# Altium project MyProject.PrjPcb
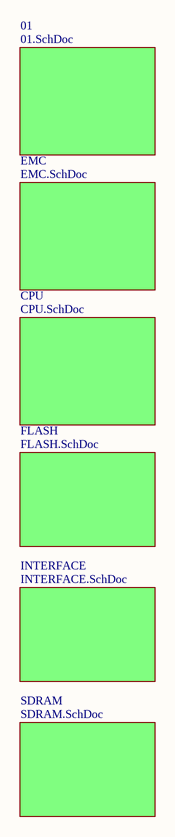
[diagram p0: Total.SchDoc]
7 sheets, 60 parts. Net scope: global (net labels, ports and power ports of the same name join across sheets).
Board file: PCB1.PcbDoc
Sheets:
  Total.SchDoc
    01 = 01.SchDoc
    CPU = CPU.SchDoc
    EMC = EMC.SchDoc
    FLASH = FLASH.SchDoc
    INTERFACE = INTERFACE.SchDoc
    SDRAM = SDRAM.SchDoc

## Sheet Total.SchDoc
size A4

### Sub-sheets
01 = 01.SchDoc: no entries
CPU = CPU.SchDoc: no entries
EMC = EMC.SchDoc: no entries
FLASH = FLASH.SchDoc: no entries
INTERFACE = INTERFACE.SchDoc: no entries
SDRAM = SDRAM.SchDoc: no entries

## Sheet 01.SchDoc
size A4
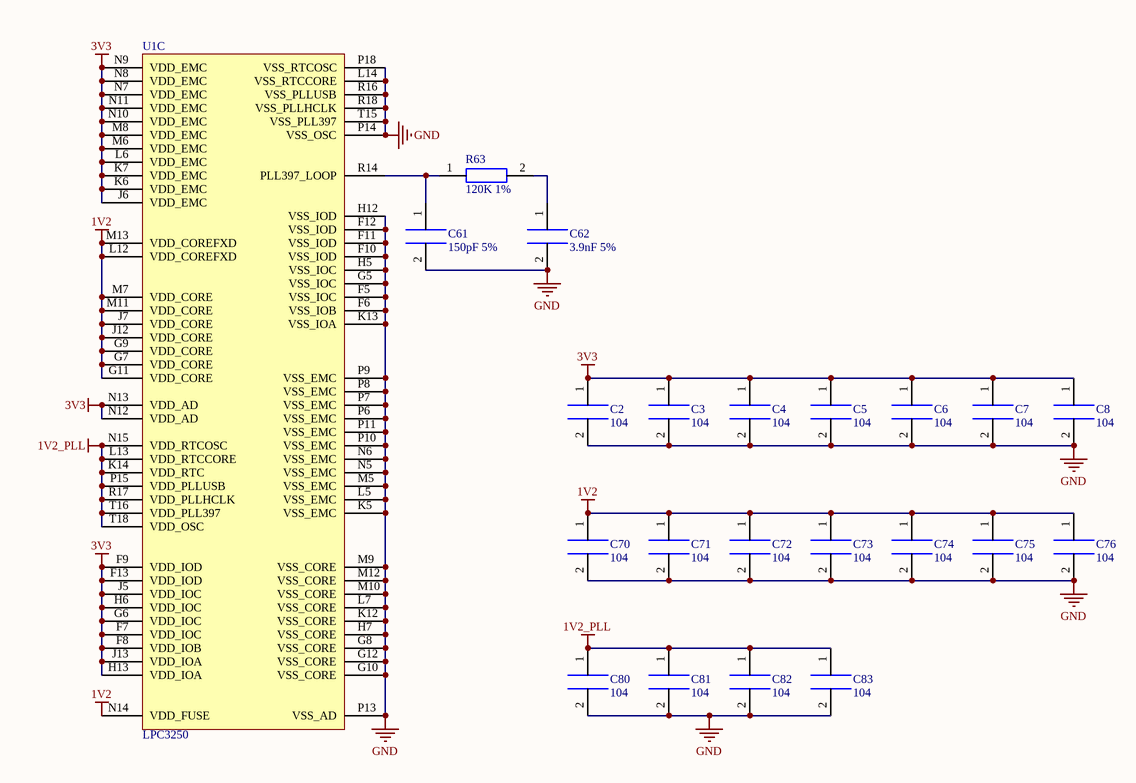
[diagram p1: 01.SchDoc]

### Parts
C2  104  [0603C]
C3  104  [0603C]
C4  104  [0603C]
C5  104  [0603C]
C6  104  [0603C]
C7  104  [0603C]
C8  104  [0603C]
C61  150pF 5%  [0603C]
C62  3.9nF 5%  [0603C]
C70  104  [0603C]
C71  104  [0603C]
C72  104  [0603C]
C73  104  [0603C]
C74  104  [0603C]
C75  104  [0603C]
C76  104  [0603C]
C80  104  [0603C]
C81  104  [0603C]
C82  104  [0603C]
C83  104  [0603C]
R63  120K 1%  [0603R]
U1  LPC3250  [TFBGA296]  (part C of 4)

### Nets
1V2: C70.1 C71.1 C72.1 C73.1 C74.1 C75.1 C76.1 U1.G7(VDD_CORE) U1.G9(VDD_CORE) U1.G11(VDD_CORE) U1.J7(VDD_CORE) U1.J12(VDD_CORE) U1.L12(VDD_COREFXD) U1.M7(VDD_CORE) U1.M11(VDD_CORE) U1.M13(VDD_COREFXD) U1.N14(VDD_FUSE)
1V2_PLL: C80.1 C81.1 C82.1 C83.1 U1.K14(VDD_RTC) U1.L13(VDD_RTCCORE) U1.N15(VDD_RTCOSC) U1.P15(VDD_PLLUSB) U1.R17(VDD_PLLHCLK) U1.T16(VDD_PLL397) U1.T18(VDD_OSC)
3V3: C2.1 C3.1 C4.1 C5.1 C6.1 C7.1 C8.1 U1.F7(VDD_IOC) U1.F8(VDD_IOB) U1.F9(VDD_IOD) U1.F13(VDD_IOD) U1.G6(VDD_IOC) U1.H6(VDD_IOC) U1.H13(VDD_IOA) U1.J5(VDD_IOC) U1.J6(VDD_EMC) U1.J13(VDD_IOA) U1.K6(VDD_EMC) U1.K7(VDD_EMC) U1.L6(VDD_EMC) U1.M6(VDD_EMC) U1.M8(VDD_EMC) U1.N7(VDD_EMC) U1.N8(VDD_EMC) U1.N9(VDD_EMC) U1.N10(VDD_EMC) U1.N11(VDD_EMC) U1.N12(VDD_AD) U1.N13(VDD_AD)
GND: C2.2 C3.2 C4.2 C5.2 C6.2 C7.2 C8.2 C61.2 C62.2 C70.2 C71.2 C72.2 C73.2 C74.2 C75.2 C76.2 C80.2 C81.2 C82.2 C83.2 U1.F5(VSS_IOC) U1.F6(VSS_IOB) U1.F10(VSS_IOD) U1.F11(VSS_IOD) U1.F12(VSS_IOD) U1.G5(VSS_IOC) U1.G8(VSS_CORE) U1.G10(VSS_CORE) U1.G12(VSS_CORE) U1.H5(VSS_IOC) U1.H7(VSS_CORE) U1.H12(VSS_IOD) U1.K5(VSS_EMC) U1.K12(VSS_CORE) U1.K13(VSS_IOA) U1.L5(VSS_EMC) U1.L7(VSS_CORE) U1.L14(VSS_RTCCORE) U1.M5(VSS_EMC) U1.M9(VSS_CORE) U1.M10(VSS_CORE) U1.M12(VSS_CORE) U1.N5(VSS_EMC) U1.N6(VSS_EMC) U1.P6(VSS_EMC) U1.P7(VSS_EMC) U1.P8(VSS_EMC) U1.P9(VSS_EMC) U1.P10(VSS_EMC) U1.P11(VSS_EMC) U1.P13(VSS_AD) U1.P14(VSS_OSC) U1.P18(VSS_RTCOSC) U1.R16(VSS_PLLUSB) U1.R18(VSS_PLLHCLK) U1.T15(VSS_PLL397)
NetC61_1: C61.1 R63.1 U1.R14(PLL397_LOOP)
NetC62_1: C62.1 R63.2

### Library data of the parts
C2-C8 C61 C62 C70-C76 C80-C83 = CAP
R63 = RES

## Sheet CPU.SchDoc
size A4
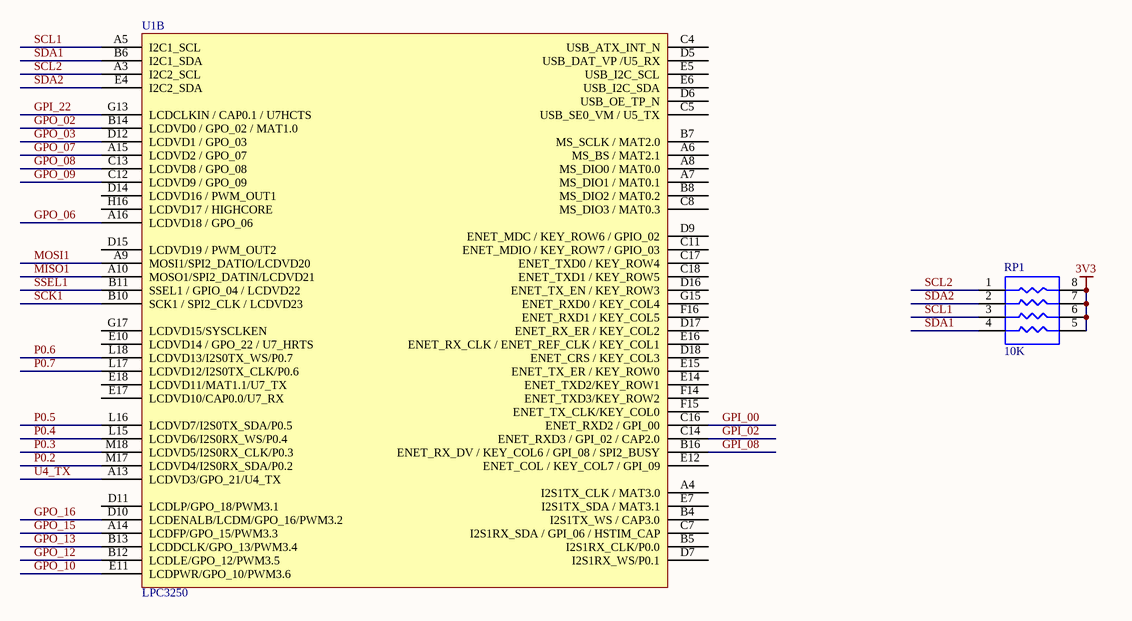
[diagram p2: CPU.SchDoc]

### Parts
RP1  10K  [PZ-4-0.8B]
U1  LPC3250  [TFBGA296]  (part B of 4)

### Nets
3V3: RP1.5 RP1.6 RP1.7 RP1.8
GPI_00: U1.C16(ENET_RXD2_/_GPI_00)
GPI_02: U1.C14(ENET_RXD3_/_GPI_02_/_CAP2.0)
GPI_08: U1.B16(ENET_RX_DV_/_KEY_COL6_/_GPI_08_/_SPI2_BUSY)
GPI_22: U1.G13(LCDCLKIN_/_CAP0.1_/_U7HCTS)
GPO_02: U1.B14(LCDVD0_/_GPO_02_/_MAT1.0)
GPO_03: U1.D12(LCDVD1_/_GPO_03)
GPO_06: U1.A16(LCDVD18_/_GPO_06)
GPO_07: U1.A15(LCDVD2_/_GPO_07)
GPO_08: U1.C13(LCDVD8_/_GPO_08)
GPO_09: U1.C12(LCDVD9_/_GPO_09)
GPO_10: U1.E11(LCDPWR/GPO_10/PWM3.6)
GPO_12: U1.B12(LCDLE/GPO_12/PWM3.5)
GPO_13: U1.B13(LCDDCLK/GPO_13/PWM3.4)
GPO_15: U1.A14(LCDFP/GPO_15/PWM3.3)
GPO_16: U1.D10(LCDENALB/LCDM/GPO_16/PWM3.2)
MISO1: U1.A10(MOSO1/SPI2_DATIN/LCDVD21)
MOSI1: U1.A9(MOSI1/SPI2_DATIO/LCDVD20)
P0.2: U1.M17(LCDVD4/I2S0RX_SDA/P0.2)
P0.3: U1.M18(LCDVD5/I2S0RX_CLK/P0.3)
P0.4: U1.L15(LCDVD6/I2S0RX_WS/P0.4)
P0.5: U1.L16(LCDVD7/I2S0TX_SDA/P0.5)
P0.6: U1.L18(LCDVD13/I2S0TX_WS/P0.7)
P0.7: U1.L17(LCDVD12/I2S0TX_CLK/P0.6)
SCK1: U1.B10(SCK1_/_SPI2_CLK_/_LCDVD23)
SCL1: RP1.3 U1.A5(I2C1_SCL)
SCL2: RP1.1 U1.A3(I2C2_SCL)
SDA1: RP1.4 U1.B6(I2C1_SDA)
SDA2: RP1.2 U1.E4(I2C2_SDA)
SSEL1: U1.B11(SSEL1_/_GPIO_04_/_LCDVD22)
U4_TX: U1.A13(LCDVD3/GPO_21/U4_TX)

Not connected (* = marked no-connect by the designer): U1 A4(I2S1TX_CLK_/_MAT3.0) A6(MS_BS_/_MAT2.1) A7(MS_DIO1_/_MAT0.1) A8(MS_DIO0_/_MAT0.0) B4(I2S1TX_WS_/_CAP3.0) B5(I2S1RX_CLK/P0.0) B7(MS_SCLK_/_MAT2.0) B8(MS_DIO2_/_MAT0.2) C4(USB_ATX_INT_N) C5(USB_SE0_VM_/_U5_TX) C7(I2S1RX_SDA_/_GPI_06_/_HSTIM_CAP) C8(MS_DIO3_/_MAT0.3) C11(ENET_MDIO_/_KEY_ROW7_/_GPIO_03) C17(ENET_TXD0_/_KEY_ROW4) C18(ENET_TXD1_/_KEY_ROW5) D5(USB_DAT_VP_/U5_RX) D6(USB_OE_TP_N) D7(I2S1RX_WS/P0.1) D9(ENET_MDC_/_KEY_ROW6_/_GPIO_02) D11(LCDLP/GPO_18/PWM3.1) D14(LCDVD16_/_PWM_OUT1) D15(LCDVD19_/_PWM_OUT2) D16(ENET_TX_EN_/_KEY_ROW3) D17(ENET_RX_ER_/_KEY_COL2) D18(ENET_CRS_/_KEY_COL3) E5(USB_I2C_SCL) E6(USB_I2C_SDA) E7(I2S1TX_SDA_/_MAT3.1) E10(LCDVD14_/_GPO_22_/_U7_HRTS) E12(ENET_COL_/_KEY_COL7_/_GPI_09) E14(ENET_TXD2/KEY_ROW1) E15(ENET_TX_ER_/_KEY_ROW0) E16(ENET_RX_CLK_/_ENET_REF_CLK_/_KEY_COL1) E17(LCDVD10/CAP0.0/U7_RX) E18(LCDVD11/MAT1.1/U7_TX) F14(ENET_TXD3/KEY_ROW2) F15(ENET_TX_CLK/KEY_COL0) F16(ENET_RXD1_/_KEY_COL5) G15(ENET_RXD0_/_KEY_COL4) G17(LCDVD15/SYSCLKEN) H16(LCDVD17_/_HIGHCORE)

### Library data of the parts
RP1 = RP

## Sheet EMC.SchDoc
size A4
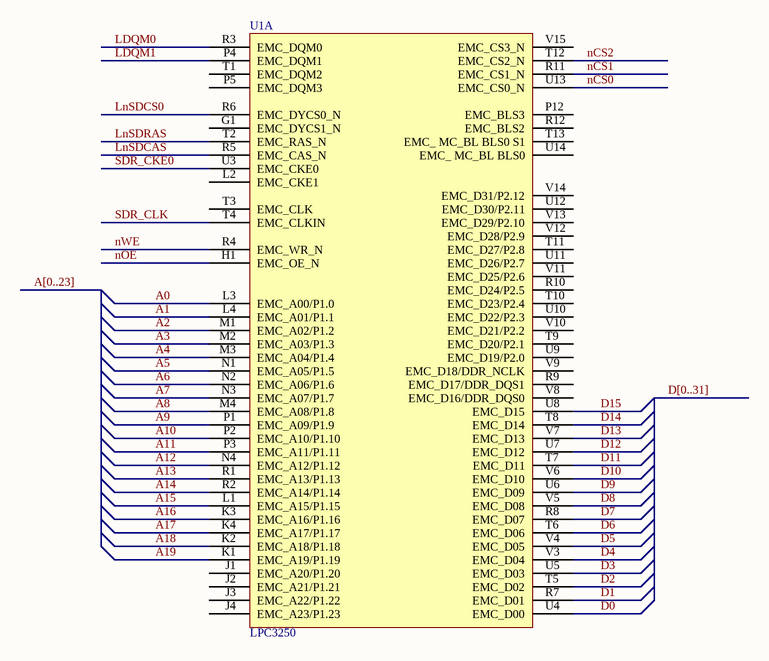
[diagram p3: EMC.SchDoc]

### Parts
U1  LPC3250  [TFBGA296]  (part A of 4)

### Nets
A0: U1.L3(EMC_A00/P1.0)
A1: U1.L4(EMC_A01/P1.1)
A2: U1.M1(EMC_A02/P1.2)
A3: U1.M2(EMC_A03/P1.3)
A4: U1.M3(EMC_A04/P1.4)
A5: U1.N1(EMC_A05/P1.5)
A6: U1.N2(EMC_A06/P1.6)
A7: U1.N3(EMC_A07/P1.7)
A8: U1.M4(EMC_A08/P1.8)
A9: U1.P1(EMC_A09/P1.9)
A10: U1.P2(EMC_A10/P1.10)
A11: U1.P3(EMC_A11/P1.11)
A12: U1.N4(EMC_A12/P1.12)
A13: U1.R1(EMC_A13/P1.13)
A14: U1.R2(EMC_A14/P1.14)
A15: U1.L1(EMC_A15/P1.15)
A16: U1.K3(EMC_A16/P1.16)
A17: U1.K4(EMC_A17/P1.17)
A18: U1.K2(EMC_A18/P1.18)
A19: U1.K1(EMC_A19/P1.19)
D0: U1.U4(EMC_D00)
D1: U1.R7(EMC_D01)
D2: U1.T5(EMC_D02)
D3: U1.U5(EMC_D03)
D4: U1.V3(EMC_D04)
D5: U1.V4(EMC_D05)
D6: U1.T6(EMC_D06)
D7: U1.R8(EMC_D07)
D8: U1.V5(EMC_D08)
D9: U1.U6(EMC_D09)
D10: U1.V6(EMC_D10)
D11: U1.T7(EMC_D11)
D12: U1.U7(EMC_D12)
D13: U1.V7(EMC_D13)
D14: U1.T8(EMC_D14)
D15: U1.U8(EMC_D15)
LDQM0: U1.R3(EMC_DQM0)
LDQM1: U1.P4(EMC_DQM1)
LnSDCAS: U1.R5(EMC_CAS_N)
LnSDCS0: U1.R6(EMC_DYCS0_N)
LnSDRAS: U1.T2(EMC_RAS_N)
nCS0: U1.U13(EMC_CS0_N)
nCS1: U1.R11(EMC_CS1_N)
nCS2: U1.T12(EMC_CS2_N)
nOE: U1.H1(EMC_OE_N)
nWE: U1.R4(EMC_WR_N)
SDR_CKE0: U1.U3(EMC_CKE0)
SDR_CLK: U1.T4(EMC_CLKIN)

Not connected (* = marked no-connect by the designer): U1 G1(EMC_DYCS1_N) J1(EMC_A20/P1.20) J2(EMC_A21/P1.21) J3(EMC_A22/P1.22) J4(EMC_A23/P1.23) L2(EMC_CKE1) P5(EMC_DQM3) P12(EMC_BLS3) R9(EMC_D17/DDR_DQS1) R10(EMC_D24/P2.5) R12(EMC_BLS2) T1(EMC_DQM2) T3(EMC_CLK) T9(EMC_D20/P2.1) T10(EMC_D23/P2.4) T11(EMC_D27/P2.8) T13(EMC__MC_BL_BLS0_S1) U9(EMC_D19/P2.0) U10(EMC_D22/P2.3) U11(EMC_D26/P2.7) U12(EMC_D30/P2.11) U14(EMC__MC_BL_BLS0) V8(EMC_D16/DDR_DQS0) V9(EMC_D18/DDR_NCLK) V10(EMC_D21/P2.2) V11(EMC_D25/P2.6) V12(EMC_D28/P2.9) V13(EMC_D29/P2.10) V14(EMC_D31/P2.12) V15(EMC_CS3_N)

### Buses and harness runs
bus A[0..23]
bus D[0..31]

## Sheet FLASH.SchDoc
size A4
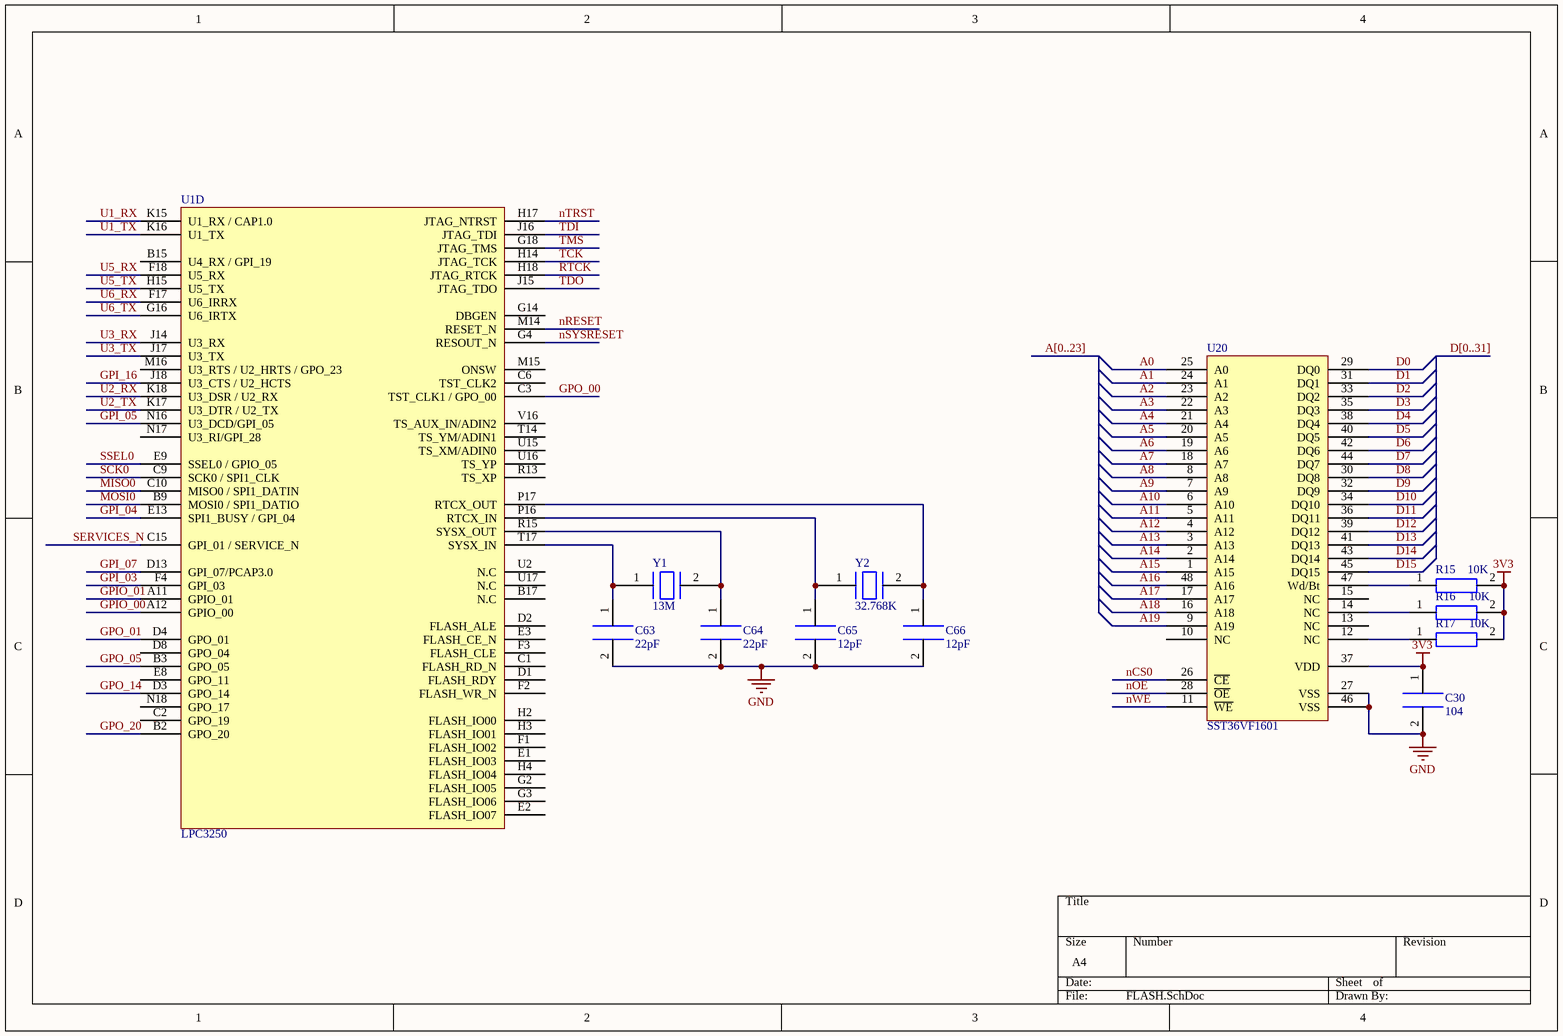
[diagram p4: FLASH.SchDoc]

### Parts
C30  104  [0603C]
C63  22pF  [0603C]
C64  22pF  [0603C]
C65  12pF  [0603C]
C66  12pF  [0603C]
R15  10K  [0603R]
R16  10K  [0603R]
R17  10K  [0603R]
U1  LPC3250  [TFBGA296]  (part D of 4)
U20  SST36VF1601  [TSOP-48]
Y1  13M  [XTAL-D]
Y2  32.768K  [XTAL-D]

### Nets
3V3: C30.1 R15.2 R16.2 R17.2 U20.37(VDD)
GND: C30.2 C63.2 C64.2 C65.2 C66.2 U20.27(VSS) U20.46(VSS)
A0: U20.25(A0)
A1: U20.24(A1)
A2: U20.23(A2)
A3: U20.22(A3)
A4: U20.21(A4)
A5: U20.20(A5)
A6: U20.19(A6)
A7: U20.18(A7)
A8: U20.8(A8)
A9: U20.7(A9)
A10: U20.6(A10)
A11: U20.5(A11)
A12: U20.4(A12)
A13: U20.3(A13)
A14: U20.2(A14)
A15: U20.1(A15)
A16: U20.48(A16)
A17: U20.17(A17)
A18: U20.16(A18)
A19: U20.9(A19)
D0: U20.29(DQ0)
D1: U20.31(DQ1)
D2: U20.33(DQ2)
D3: U20.35(DQ3)
D4: U20.38(DQ4)
D5: U20.40(DQ5)
D6: U20.42(DQ6)
D7: U20.44(DQ7)
D8: U20.30(DQ8)
D9: U20.32(DQ9)
D10: U20.34(DQ10)
D11: U20.36(DQ11)
D12: U20.39(DQ12)
D13: U20.41(DQ13)
D14: U20.43(DQ14)
D15: U20.45(DQ15)
GPI_03: U1.F4(GPI_03)
GPI_04: U1.E13(SPI1_BUSY_/_GPI_04)
GPI_05: U1.N16(U3_DCD/GPI_05)
GPI_07: U1.D13(GPI_07/PCAP3.0)
GPI_16: U1.J18(U3_CTS_/_U2_HCTS)
GPIO_00: U1.A12(GPIO_00)
GPIO_01: U1.A11(GPIO_01)
GPO_00: U1.C3(TST_CLK1_/_GPO_00)
GPO_01: U1.D4(GPO_01)
GPO_05: U1.B3(GPO_05)
GPO_14: U1.D3(GPO_14)
GPO_20: U1.B2(GPO_20)
MISO0: U1.C10(MISO0_/_SPI1_DATIN)
MOSI0: U1.B9(MOSI0_/_SPI1_DATIO)
nCS0: U20.26(~{CE})
nOE: U20.28(~{OE})
nRESET: U1.M14(RESET_N)
nSYSRESET: U1.G4(RESOUT_N)
nTRST: U1.H17(JTAG_NTRST)
nWE: U20.11(~{WE})
RTCK: U1.H18(JTAG_RTCK)
SCK0: U1.C9(SCK0_/_SPI1_CLK)
SERVICES_N: U1.C15(GPI_01_/_SERVICE_N)
SSEL0: U1.E9(SSEL0_/_GPIO_05)
TCK: U1.H14(JTAG_TCK)
TDI: U1.J16(JTAG_TDI)
TDO: U1.J15(JTAG_TDO)
TMS: U1.G18(JTAG_TMS)
U1_RX: U1.K15(U1_RX_/_CAP1.0)
U1_TX: U1.K16(U1_TX)
U2_RX: U1.K18(U3_DSR_/_U2_RX)
U2_TX: U1.K17(U3_DTR_/_U2_TX)
U3_RX: U1.J14(U3_RX)
U3_TX: U1.J17(U3_TX)
U5_RX: U1.F18(U5_RX)
U5_TX: U1.H15(U5_TX)
U6_RX: U1.F17(U6_IRRX)
U6_TX: U1.G16(U6_IRTX)
NetC63_1: C63.1 U1.T17(SYSX_IN) Y1.1
NetC64_1: C64.1 U1.R15(SYSX_OUT) Y1.2
NetC65_1: C65.1 U1.P16(RTCX_IN) Y2.1
NetC66_1: C66.1 U1.P17(RTCX_OUT) Y2.2
NetR15_1: R15.1 U20.47(Wd/Bt)
NetR16_1: R16.1 U20.14(NC)
NetR17_1: R17.1 U20.12(NC)

Not connected (* = marked no-connect by the designer): U1 B15(U4_RX_/_GPI_19) B17(N.C) C1(FLASH_RD_N) C2(GPO_19) C6(TST_CLK2) D1(FLASH_RDY) D2(FLASH_ALE) D8(GPO_04) E1(FLASH_IO03) E2(FLASH_IO07) E3(FLASH_CE_N) E8(GPO_11) F1(FLASH_IO02) F2(FLASH_WR_N) F3(FLASH_CLE) G2(FLASH_IO05) G3(FLASH_IO06) G14(DBGEN) H2(FLASH_IO00) H3(FLASH_IO01) H4(FLASH_IO04) M15(ONSW) M16(U3_RTS_/_U2_HRTS_/_GPO_23) N17(U3_RI/GPI_28) N18(GPO_17) R13(TS_XP) T14(TS_YM/ADIN1) U2(N.C) U15(TS_XM/ADIN0) U16(TS_YP) U17(N.C) V16(TS_AUX_IN/ADIN2); U20 10(NC) 13(NC) 15(NC)

### Buses and harness runs
bus A[0..23]
bus D[0..31]

### Library data of the parts
C30 C63-C66 = CAP
R15-R17 = RES
Y1 Y2 = Y

## Sheet INTERFACE.SchDoc
size A3
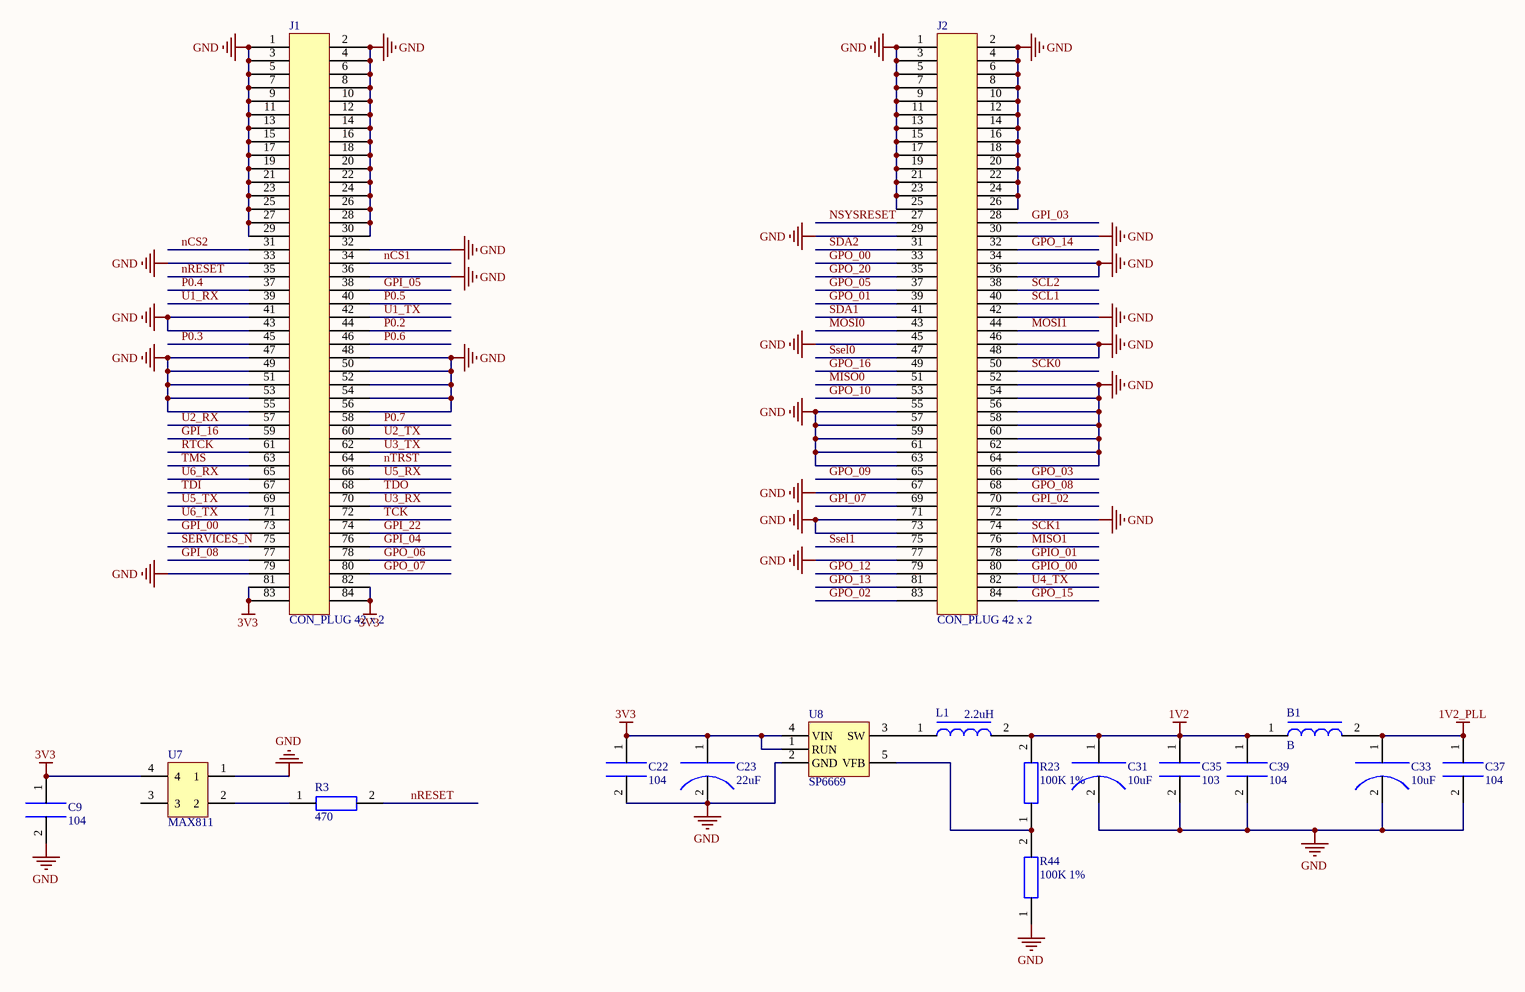
[diagram p5: INTERFACE.SchDoc]

### Parts
B1  B  [0603]
C9  104  [0603C]
C22  104  [0603C]
C23  22uF  [TC-3528]
C31  10uF  [TC-3528]
C33  10uF  [TC-3528]
C35  103  [0603C]
C37  104  [0603C]
C39  104  [0603C]
J1  CON_PLUG 42 x 2  [DIP84]
J2  CON_PLUG 42 x 2  [DIP84]
L1  2.2uH  [0805]
R3  470  [0603R]
R23  100K 1%  [0603R]
R44  100K 1%  [0603R]
U7  MAX811  [MAX811]
U8  SP6669  [SOT-23-5]

### Nets
1V2: B1.1 C31.1 C35.1 C39.1 L1.2 R23.2
1V2_PLL: B1.2 C33.1 C37.1
3V3: C9.1 C22.1 C23.1 J1.81 J1.82 J1.83 J1.84 U7.4 U8.1(RUN) U8.4(VIN)
GND: C9.2 C22.2 C23.2 C31.2 C33.2 C35.2 C37.2 C39.2 J1.1 J1.2 J1.3 J1.4 J1.5 J1.6 J1.7 J1.8 J1.9 J1.10 J1.11 J1.12 J1.13 J1.14 J1.15 J1.16 J1.17 J1.18 J1.19 J1.20 J1.21 J1.22 J1.23 J1.24 J1.25 J1.26 J1.27 J1.28 J1.29 J1.30 J1.32 J1.33 J1.36 J1.41 J1.43 J1.47 J1.48 J1.49 J1.50 J1.51 J1.52 J1.53 J1.54 J1.55 J1.56 J1.79 J2.1 J2.2 J2.3 J2.4 J2.5 J2.6 J2.7 J2.8 J2.9 J2.10 J2.11 J2.12 J2.13 J2.14 J2.15 J2.16 J2.17 J2.18 J2.19 J2.20 J2.21 J2.22 J2.23 J2.24 J2.25 J2.26 J2.29 J2.30 J2.34 J2.36 J2.42 J2.45 J2.46 J2.48 J2.52 J2.54 J2.55 J2.56 J2.57 J2.58 J2.59 J2.60 J2.61 J2.62 J2.63 J2.64 J2.67 J2.71 J2.72 J2.73 J2.77 R44.1 U7.1 U8.2(GND)
GPI_00: J1.73
GPI_02: J2.70
GPI_03: J2.28
GPI_04: J1.76
GPI_05: J1.38
GPI_07: J2.69
GPI_08: J1.77
GPI_16: J1.59
GPI_22: J1.74
GPIO_00: J2.80
GPIO_01: J2.78
GPO_00: J2.33
GPO_01: J2.39
GPO_02: J2.83
GPO_03: J2.66
GPO_05: J2.37
GPO_06: J1.78
GPO_07: J1.80
GPO_08: J2.68
GPO_09: J2.65
GPO_10: J2.53
GPO_12: J2.79
GPO_13: J2.81
GPO_14: J2.32
GPO_15: J2.84
GPO_16: J2.49
GPO_20: J2.35
MISO0: J2.51
MISO1: J2.76
MOSI0: J2.43
MOSI1: J2.44
nCS1: J1.34
nCS2: J1.31
nRESET: J1.35 R3.2
nSYSRESET: J2.27
nTRST: J1.64
P0.2: J1.44
P0.3: J1.45
P0.4: J1.37
P0.5: J1.40
P0.6: J1.46
P0.7: J1.58
RTCK: J1.61
SCK0: J2.50
SCK1: J2.74
SCL1: J2.40
SCL2: J2.38
SDA1: J2.41
SDA2: J2.31
SERVICES_N: J1.75
SSEL0: J2.47
SSEL1: J2.75
TCK: J1.72
TDI: J1.67
TDO: J1.68
TMS: J1.63
U1_RX: J1.39
U1_TX: J1.42
U2_RX: J1.57
U2_TX: J1.60
U3_RX: J1.70
U3_TX: J1.62
U4_TX: J2.82
U5_RX: J1.66
U5_TX: J1.69
U6_RX: J1.65
U6_TX: J1.71
NetL1_1: L1.1 U8.3(SW)
NetR3_1: R3.1 U7.2
NetR23_1: R23.1 R44.2 U8.5(VFB)

Not connected (* = marked no-connect by the designer): U7 3

### Library data of the parts
C9 C22 C35 C37 C39 = CAP
C23 C31 C33 = CAP_1
L1 = INDUCTOR
R3 R23 R44 = RES

## Sheet SDRAM.SchDoc
size A4
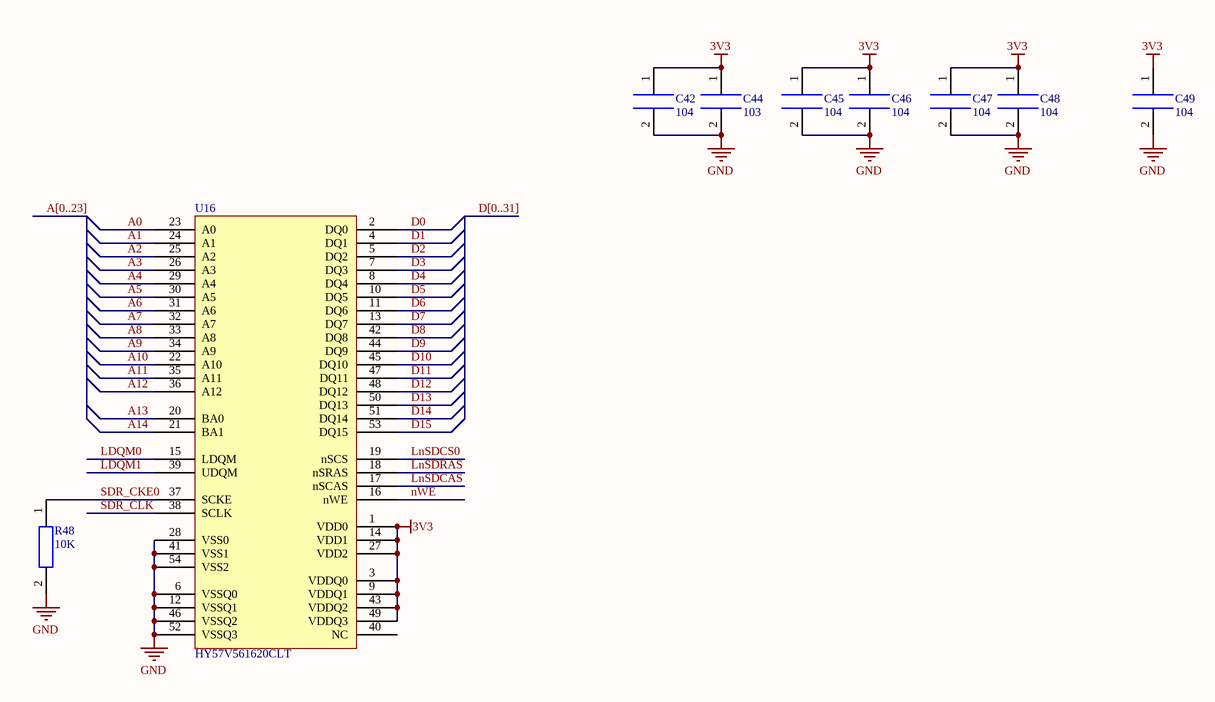
[diagram p6: SDRAM.SchDoc]

### Parts
C42  104  [0603C]
C44  103  [0603C]
C45  104  [0603C]
C46  104  [0603C]
C47  104  [0603C]
C48  104  [0603C]
C49  104  [0603C]
R48  10K  [0603R]
U16  HY57V561620CLT  [TSSOP-54]

### Nets
3V3: C42.1 C44.1 C45.1 C46.1 C47.1 C48.1 C49.1 U16.1(VDD0) U16.3(VDDQ0) U16.9(VDDQ1) U16.14(VDD1) U16.27(VDD2) U16.43(VDDQ2) U16.49(VDDQ3)
GND: C42.2 C44.2 C45.2 C46.2 C47.2 C48.2 C49.2 R48.2 U16.6(VSSQ0) U16.12(VSSQ1) U16.28(VSS0) U16.41(VSS1) U16.46(VSSQ2) U16.52(VSSQ3) U16.54(VSS2)
A0: U16.23(A0)
A1: U16.24(A1)
A2: U16.25(A2)
A3: U16.26(A3)
A4: U16.29(A4)
A5: U16.30(A5)
A6: U16.31(A6)
A7: U16.32(A7)
A8: U16.33(A8)
A9: U16.34(A9)
A10: U16.22(A10)
A11: U16.35(A11)
A12: U16.36(A12)
A13: U16.20(BA0)
A14: U16.21(BA1)
D0: U16.2(DQ0)
D1: U16.4(DQ1)
D2: U16.5(DQ2)
D3: U16.7(DQ3)
D4: U16.8(DQ4)
D5: U16.10(DQ5)
D6: U16.11(DQ6)
D7: U16.13(DQ7)
D8: U16.42(DQ8)
D9: U16.44(DQ9)
D10: U16.45(DQ10)
D11: U16.47(DQ11)
D12: U16.48(DQ12)
D13: U16.50(DQ13)
D14: U16.51(DQ14)
D15: U16.53(DQ15)
LDQM0: U16.15(LDQM)
LDQM1: U16.39(UDQM)
LnSDCAS: U16.17(nSCAS)
LnSDCS0: U16.19(nSCS)
LnSDRAS: U16.18(nSRAS)
nWE: U16.16(nWE)
SDR_CKE0: R48.1 U16.37(SCKE)
SDR_CLK: U16.38(SCLK)

Not connected (* = marked no-connect by the designer): U16 40(NC)

### Buses and harness runs
bus A[0..23]
bus D[0..31]

### Library data of the parts
C42 C44-C49 = CAP
R48 = RES

## Nets that join several sheets
1V2: 01 (17 pins), INTERFACE (6 pins)
1V2_PLL: 01 (11 pins), INTERFACE (B1.2 C33.1 C37.1)
3V3: 01 (29 pins), CPU (RP1.5 RP1.6 RP1.7 RP1.8), FLASH (5 pins), INTERFACE (10 pins), SDRAM (14 pins)
GND: 01 (56 pins), FLASH (7 pins), INTERFACE (108 pins), SDRAM (15 pins)
A0: EMC (U1.L3), FLASH (U20.25), SDRAM (U16.23)
A1: EMC (U1.L4), FLASH (U20.24), SDRAM (U16.24)
A2: EMC (U1.M1), FLASH (U20.23), SDRAM (U16.25)
A3: EMC (U1.M2), FLASH (U20.22), SDRAM (U16.26)
A4: EMC (U1.M3), FLASH (U20.21), SDRAM (U16.29)
A5: EMC (U1.N1), FLASH (U20.20), SDRAM (U16.30)
A6: EMC (U1.N2), FLASH (U20.19), SDRAM (U16.31)
A7: EMC (U1.N3), FLASH (U20.18), SDRAM (U16.32)
A8: EMC (U1.M4), FLASH (U20.8), SDRAM (U16.33)
A9: EMC (U1.P1), FLASH (U20.7), SDRAM (U16.34)
A10: EMC (U1.P2), FLASH (U20.6), SDRAM (U16.22)
A11: EMC (U1.P3), FLASH (U20.5), SDRAM (U16.35)
A12: EMC (U1.N4), FLASH (U20.4), SDRAM (U16.36)
A13: EMC (U1.R1), FLASH (U20.3), SDRAM (U16.20)
A14: EMC (U1.R2), FLASH (U20.2), SDRAM (U16.21)
A15: EMC (U1.L1), FLASH (U20.1)
A16: EMC (U1.K3), FLASH (U20.48)
A17: EMC (U1.K4), FLASH (U20.17)
A18: EMC (U1.K2), FLASH (U20.16)
A19: EMC (U1.K1), FLASH (U20.9)
D0: EMC (U1.U4), FLASH (U20.29), SDRAM (U16.2)
D1: EMC (U1.R7), FLASH (U20.31), SDRAM (U16.4)
D2: EMC (U1.T5), FLASH (U20.33), SDRAM (U16.5)
D3: EMC (U1.U5), FLASH (U20.35), SDRAM (U16.7)
D4: EMC (U1.V3), FLASH (U20.38), SDRAM (U16.8)
D5: EMC (U1.V4), FLASH (U20.40), SDRAM (U16.10)
D6: EMC (U1.T6), FLASH (U20.42), SDRAM (U16.11)
D7: EMC (U1.R8), FLASH (U20.44), SDRAM (U16.13)
D8: EMC (U1.V5), FLASH (U20.30), SDRAM (U16.42)
D9: EMC (U1.U6), FLASH (U20.32), SDRAM (U16.44)
D10: EMC (U1.V6), FLASH (U20.34), SDRAM (U16.45)
D11: EMC (U1.T7), FLASH (U20.36), SDRAM (U16.47)
D12: EMC (U1.U7), FLASH (U20.39), SDRAM (U16.48)
D13: EMC (U1.V7), FLASH (U20.41), SDRAM (U16.50)
D14: EMC (U1.T8), FLASH (U20.43), SDRAM (U16.51)
D15: EMC (U1.U8), FLASH (U20.45), SDRAM (U16.53)
GPI_00: CPU (U1.C16), INTERFACE (J1.73)
GPI_02: CPU (U1.C14), INTERFACE (J2.70)
GPI_03: FLASH (U1.F4), INTERFACE (J2.28)
GPI_04: FLASH (U1.E13), INTERFACE (J1.76)
GPI_05: FLASH (U1.N16), INTERFACE (J1.38)
GPI_07: FLASH (U1.D13), INTERFACE (J2.69)
GPI_08: CPU (U1.B16), INTERFACE (J1.77)
GPI_16: FLASH (U1.J18), INTERFACE (J1.59)
GPI_22: CPU (U1.G13), INTERFACE (J1.74)
GPIO_00: FLASH (U1.A12), INTERFACE (J2.80)
GPIO_01: FLASH (U1.A11), INTERFACE (J2.78)
GPO_00: FLASH (U1.C3), INTERFACE (J2.33)
GPO_01: FLASH (U1.D4), INTERFACE (J2.39)
GPO_02: CPU (U1.B14), INTERFACE (J2.83)
GPO_03: CPU (U1.D12), INTERFACE (J2.66)
GPO_05: FLASH (U1.B3), INTERFACE (J2.37)
GPO_06: CPU (U1.A16), INTERFACE (J1.78)
GPO_07: CPU (U1.A15), INTERFACE (J1.80)
GPO_08: CPU (U1.C13), INTERFACE (J2.68)
GPO_09: CPU (U1.C12), INTERFACE (J2.65)
GPO_10: CPU (U1.E11), INTERFACE (J2.53)
GPO_12: CPU (U1.B12), INTERFACE (J2.79)
GPO_13: CPU (U1.B13), INTERFACE (J2.81)
GPO_14: FLASH (U1.D3), INTERFACE (J2.32)
GPO_15: CPU (U1.A14), INTERFACE (J2.84)
GPO_16: CPU (U1.D10), INTERFACE (J2.49)
GPO_20: FLASH (U1.B2), INTERFACE (J2.35)
LDQM0: EMC (U1.R3), SDRAM (U16.15)
LDQM1: EMC (U1.P4), SDRAM (U16.39)
LnSDCAS: EMC (U1.R5), SDRAM (U16.17)
LnSDCS0: EMC (U1.R6), SDRAM (U16.19)
LnSDRAS: EMC (U1.T2), SDRAM (U16.18)
MISO0: FLASH (U1.C10), INTERFACE (J2.51)
MISO1: CPU (U1.A10), INTERFACE (J2.76)
MOSI0: FLASH (U1.B9), INTERFACE (J2.43)
MOSI1: CPU (U1.A9), INTERFACE (J2.44)
nCS0: EMC (U1.U13), FLASH (U20.26)
nCS1: EMC (U1.R11), INTERFACE (J1.34)
nCS2: EMC (U1.T12), INTERFACE (J1.31)
nOE: EMC (U1.H1), FLASH (U20.28)
nRESET: FLASH (U1.M14), INTERFACE (J1.35 R3.2)
nSYSRESET: FLASH (U1.G4), INTERFACE (J2.27)
nTRST: FLASH (U1.H17), INTERFACE (J1.64)
nWE: EMC (U1.R4), FLASH (U20.11), SDRAM (U16.16)
P0.2: CPU (U1.M17), INTERFACE (J1.44)
P0.3: CPU (U1.M18), INTERFACE (J1.45)
P0.4: CPU (U1.L15), INTERFACE (J1.37)
P0.5: CPU (U1.L16), INTERFACE (J1.40)
P0.6: CPU (U1.L18), INTERFACE (J1.46)
P0.7: CPU (U1.L17), INTERFACE (J1.58)
RTCK: FLASH (U1.H18), INTERFACE (J1.61)
SCK0: FLASH (U1.C9), INTERFACE (J2.50)
SCK1: CPU (U1.B10), INTERFACE (J2.74)
SCL1: CPU (RP1.3 U1.A5), INTERFACE (J2.40)
SCL2: CPU (RP1.1 U1.A3), INTERFACE (J2.38)
SDA1: CPU (RP1.4 U1.B6), INTERFACE (J2.41)
SDA2: CPU (RP1.2 U1.E4), INTERFACE (J2.31)
SDR_CKE0: EMC (U1.U3), SDRAM (R48.1 U16.37)
SDR_CLK: EMC (U1.T4), SDRAM (U16.38)
SERVICES_N: FLASH (U1.C15), INTERFACE (J1.75)
SSEL0: FLASH (U1.E9), INTERFACE (J2.47)
SSEL1: CPU (U1.B11), INTERFACE (J2.75)
TCK: FLASH (U1.H14), INTERFACE (J1.72)
TDI: FLASH (U1.J16), INTERFACE (J1.67)
TDO: FLASH (U1.J15), INTERFACE (J1.68)
TMS: FLASH (U1.G18), INTERFACE (J1.63)
U1_RX: FLASH (U1.K15), INTERFACE (J1.39)
U1_TX: FLASH (U1.K16), INTERFACE (J1.42)
U2_RX: FLASH (U1.K18), INTERFACE (J1.57)
U2_TX: FLASH (U1.K17), INTERFACE (J1.60)
U3_RX: FLASH (U1.J14), INTERFACE (J1.70)
U3_TX: FLASH (U1.J17), INTERFACE (J1.62)
U4_TX: CPU (U1.A13), INTERFACE (J2.82)
U5_RX: FLASH (U1.F18), INTERFACE (J1.66)
U5_TX: FLASH (U1.H15), INTERFACE (J1.69)
U6_RX: FLASH (U1.F17), INTERFACE (J1.65)
U6_TX: FLASH (U1.G16), INTERFACE (J1.71)